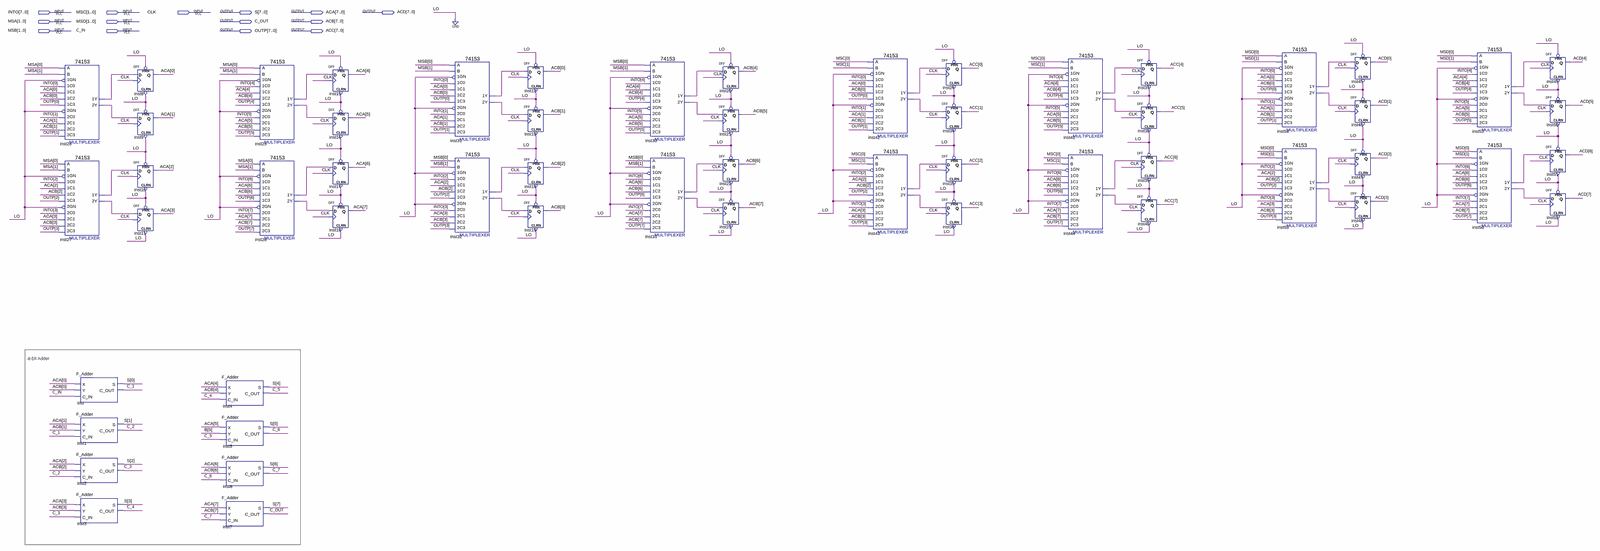
[diagram p0: schematic sheet, whole]
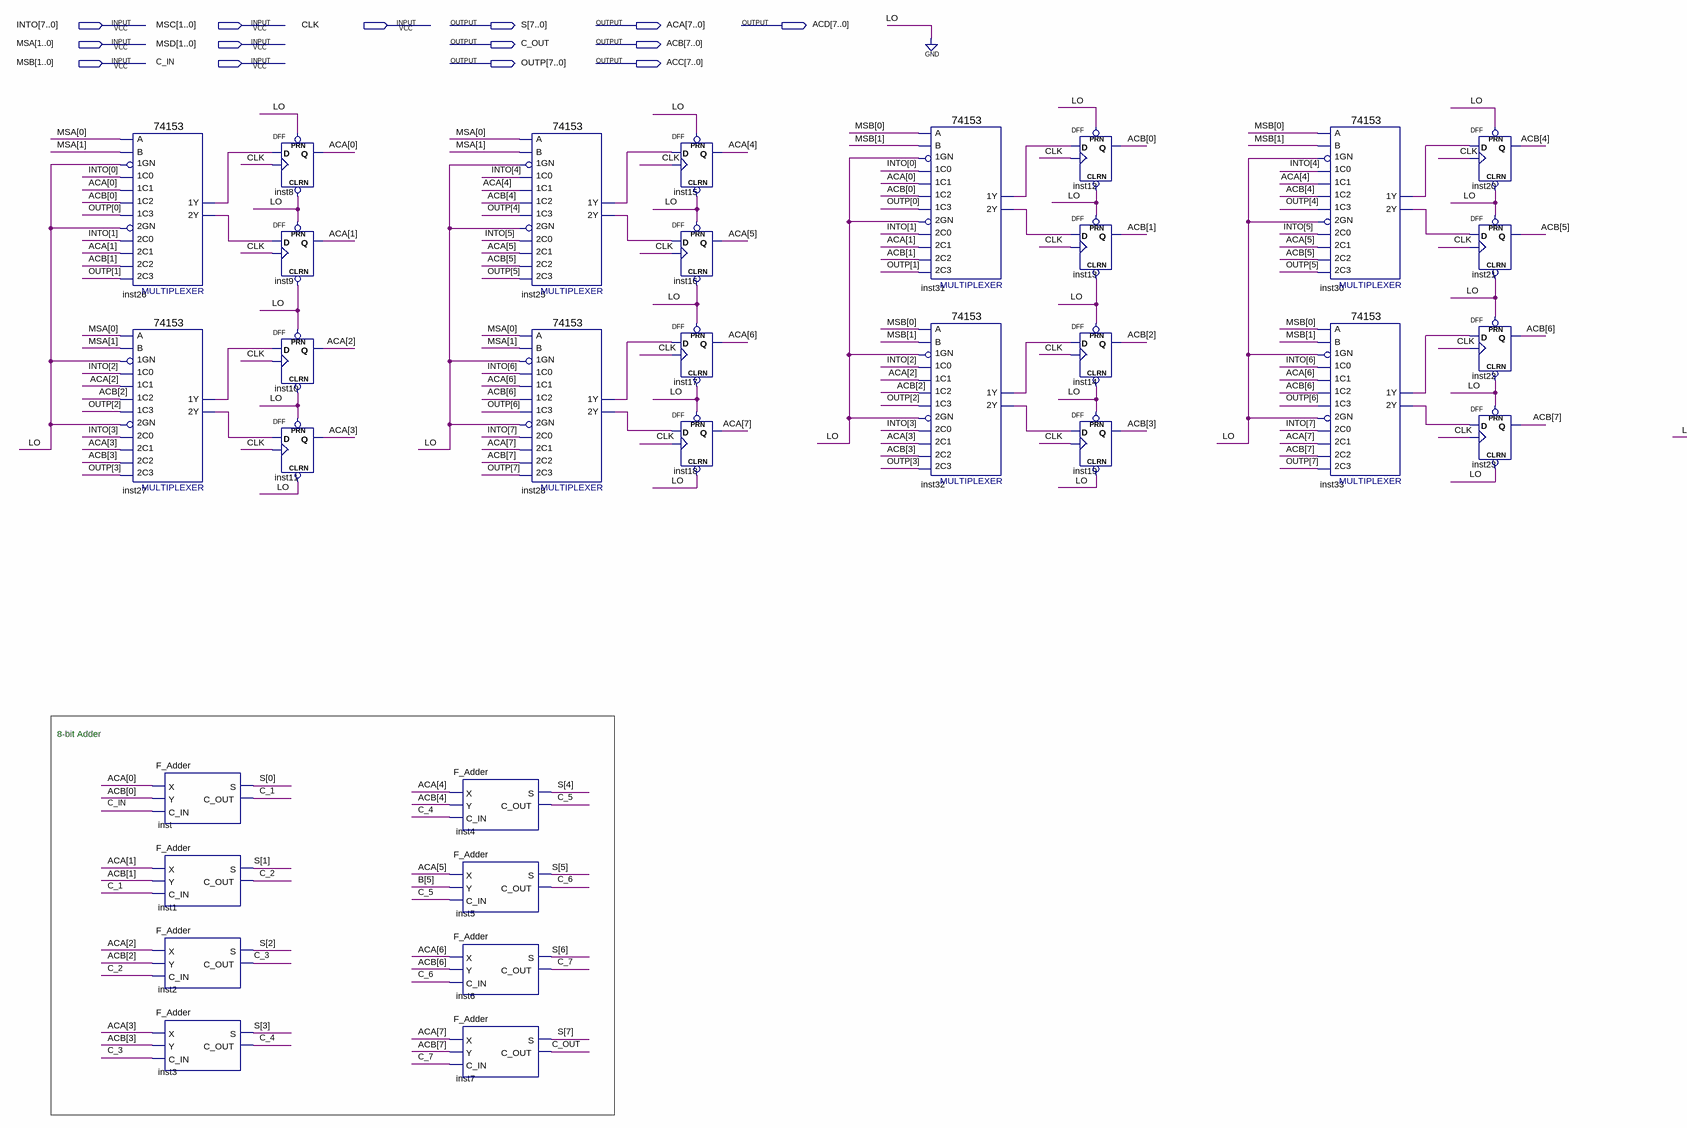
[diagram p1: schematic sheet, left part]
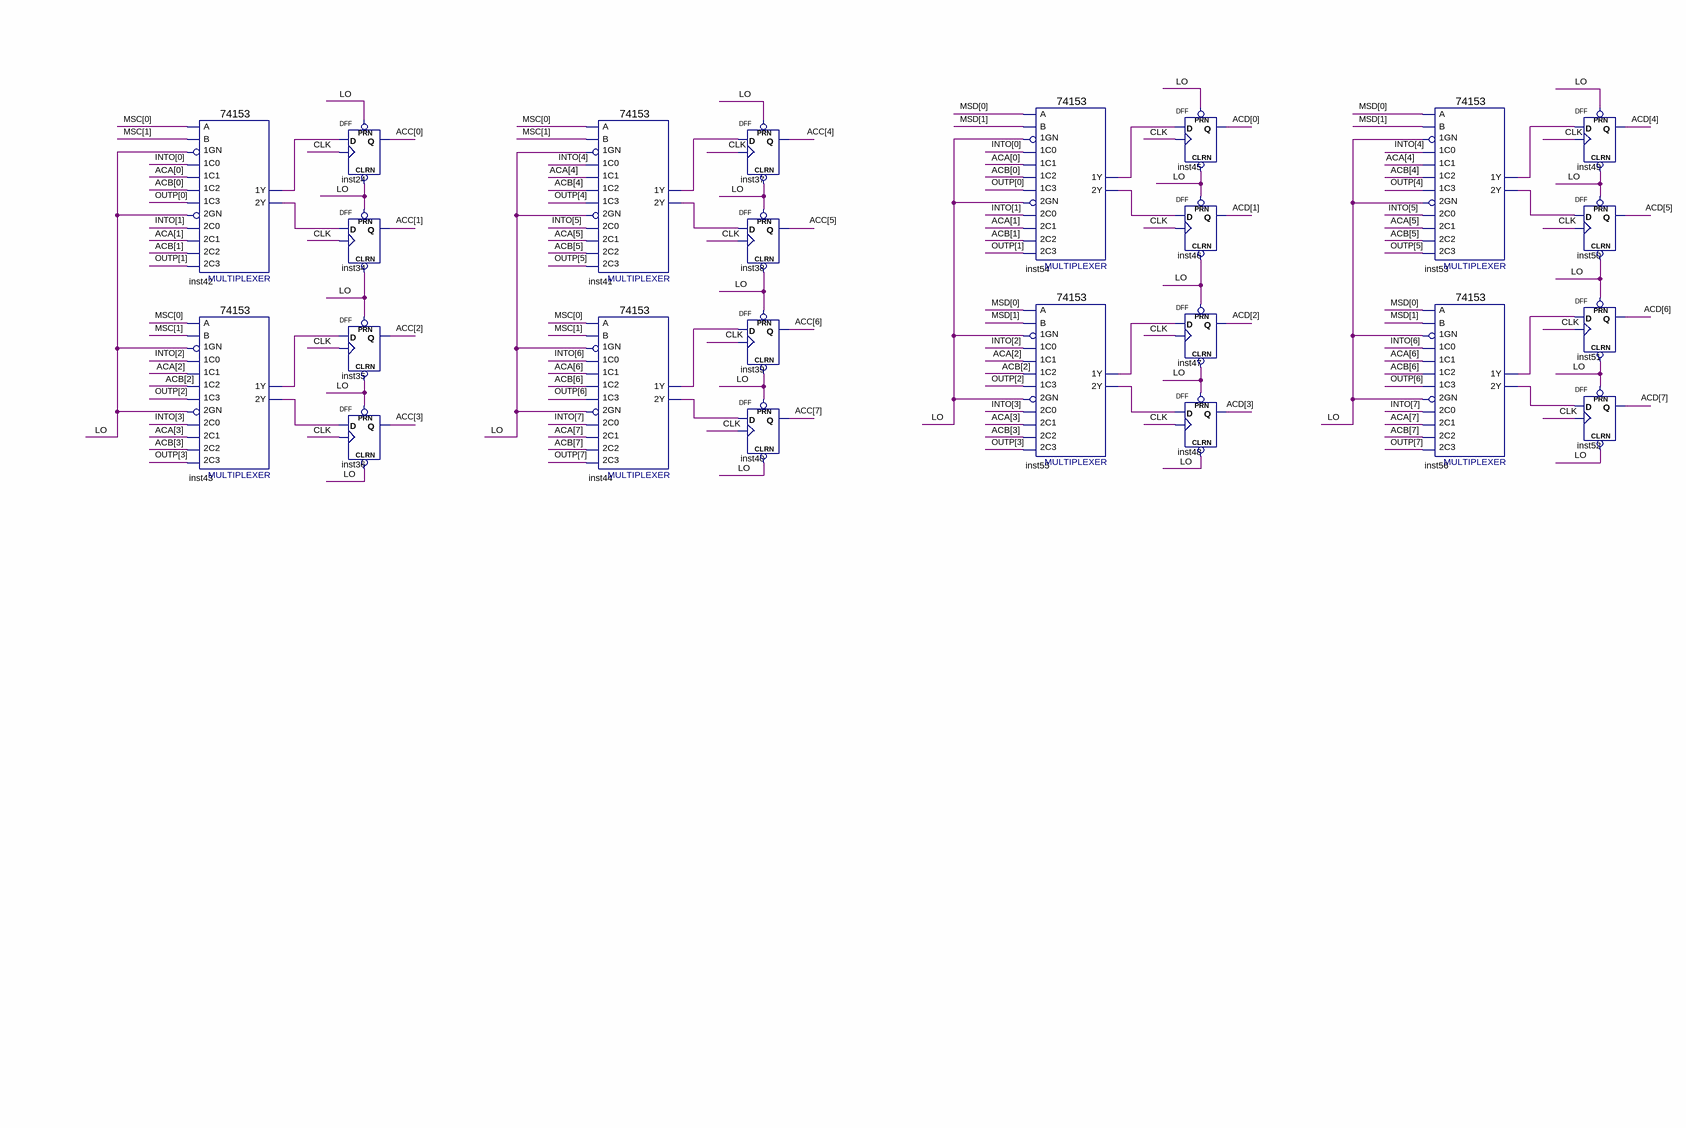
[diagram p2: schematic sheet, right part]
// Quartus schematic V_ALU.bdf as structural Verilog: 56 symbols, 14 pins
module V_ALU (
  input  [7:0] INTO,
  input  [1:0] MSC,
  input  CLK,
  input  [1:0] MSA,
  input  [1:0] MSD,
  input  [1:0] MSB,
  input  C_IN,
  output [7:0] S,
  output [7:0] ACA,
  output [7:0] ACD,
  output C_OUT,
  output [7:0] ACB,
  output [7:0] OUTP,
  output [7:0] ACC
);

  wire C_1, C_2, C_3, C_4, C_5, C_6, C_7, inst25_1y, inst25_2y, inst26_1y, inst26_2y, inst27_1y, inst27_2y,
       inst28_1y, inst28_2y, inst30_1y, inst30_2y, inst31_1y, inst31_2y, inst32_1y, inst32_2y, inst33_1y,
       inst33_2y, inst41_1y, inst41_2y, inst42_1y, inst42_2y, inst43_1y, inst43_2y, inst44_1y, inst44_2y,
       inst53_1y, inst53_2y, inst54_1y, inst54_2y, inst55_1y, inst55_2y, inst56_1y, inst56_2y;
  wire [5:5] B;

  \74153  inst26 (
    .\1C1 (ACA[0]), .\1GN (1'b0), .\1C0 (INTO[0]), .\2C0 (INTO[1]), .\2GN (1'b0), .\2C2 (ACB[1]),
    .\1C2 (ACB[0]), .\1C3 (OUTP[0]), .B(MSA[1]), .A(MSA[0]), .\2C1 (ACA[1]), .\2C3 (OUTP[1]),
    .\1Y (inst26_1y), .\2Y (inst26_2y));
  \74153  inst27 (
    .\1C1 (ACA[2]), .\1GN (1'b0), .\1C0 (INTO[2]), .\2C0 (INTO[3]), .\2GN (1'b0), .\2C2 (ACB[3]),
    .\1C2 (ACB[2]), .\1C3 (OUTP[2]), .B(MSA[1]), .A(MSA[0]), .\2C1 (ACA[3]), .\2C3 (OUTP[3]),
    .\1Y (inst27_1y), .\2Y (inst27_2y));
  F_Adder inst (.X(ACA[0]), .Y(ACB[0]), .C_IN(C_IN), .S(S[0]), .C_OUT(C_1));
  F_Adder inst1 (.X(ACA[1]), .Y(ACB[1]), .C_IN(C_1), .S(S[1]), .C_OUT(C_2));
  F_Adder inst2 (.X(ACA[2]), .Y(ACB[2]), .C_IN(C_2), .S(S[2]), .C_OUT(C_3));
  F_Adder inst3 (.X(ACA[3]), .Y(ACB[3]), .C_IN(C_3), .S(S[3]), .C_OUT(C_4));
  DFF inst8 (.CLRN(1'b0), .CLK(CLK), .D(inst26_1y), .PRN(1'b0), .Q(ACA[0]));
  DFF inst9 (.CLRN(1'b0), .CLK(CLK), .D(inst26_2y), .PRN(1'b0), .Q(ACA[1]));
  DFF inst10 (.CLRN(1'b0), .CLK(CLK), .D(inst27_1y), .PRN(1'b0), .Q(ACA[2]));
  DFF inst11 (.CLRN(1'b0), .CLK(CLK), .D(inst27_2y), .PRN(1'b0), .Q(ACA[3]));
  F_Adder inst4 (.X(ACA[4]), .Y(ACB[4]), .C_IN(C_4), .S(S[4]), .C_OUT(C_5));
  F_Adder inst5 (.X(ACA[5]), .Y(B[5]), .C_IN(C_5), .S(S[5]), .C_OUT(C_6));
  F_Adder inst6 (.X(ACA[6]), .Y(ACB[6]), .C_IN(C_6), .S(S[6]), .C_OUT(C_7));
  F_Adder inst7 (.X(ACA[7]), .Y(ACB[7]), .C_IN(C_7), .S(S[7]), .C_OUT(C_OUT));
  \74153  inst25 (
    .\1C1 (ACA[4]), .\1GN (1'b0), .\1C0 (INTO[4]), .\2C0 (INTO[5]), .\2GN (1'b0), .\2C2 (ACB[5]),
    .\1C2 (ACB[4]), .\1C3 (OUTP[4]), .B(MSA[1]), .A(MSA[0]), .\2C1 (ACA[5]), .\2C3 (OUTP[5]),
    .\1Y (inst25_1y), .\2Y (inst25_2y));
  \74153  inst28 (
    .\1C1 (ACA[6]), .\1GN (1'b0), .\1C0 (INTO[6]), .\2C0 (INTO[7]), .\2GN (1'b0), .\2C2 (ACB[7]),
    .\1C2 (ACB[6]), .\1C3 (OUTP[6]), .B(MSA[1]), .A(MSA[0]), .\2C1 (ACA[7]), .\2C3 (OUTP[7]),
    .\1Y (inst28_1y), .\2Y (inst28_2y));
  DFF inst15 (.CLRN(1'b0), .CLK(CLK), .D(inst25_1y), .PRN(1'b0), .Q(ACA[4]));
  DFF inst16 (.CLRN(1'b0), .CLK(CLK), .D(inst25_2y), .PRN(1'b0), .Q(ACA[5]));
  DFF inst17 (.CLRN(1'b0), .CLK(CLK), .D(inst28_1y), .PRN(1'b0), .Q(ACA[6]));
  DFF inst18 (.CLRN(1'b0), .CLK(CLK), .D(inst28_2y), .PRN(1'b0), .Q(ACA[7]));
  \74153  inst31 (
    .\1C1 (ACA[0]), .\1GN (1'b0), .\1C0 (INTO[0]), .\2C0 (INTO[1]), .\2GN (1'b0), .\2C2 (ACB[1]),
    .\1C2 (ACB[0]), .\1C3 (OUTP[0]), .B(MSB[1]), .A(MSB[0]), .\2C1 (ACA[1]), .\2C3 (OUTP[1]),
    .\1Y (inst31_1y), .\2Y (inst31_2y));
  \74153  inst32 (
    .\1C1 (ACA[2]), .\1GN (1'b0), .\1C0 (INTO[2]), .\2C0 (INTO[3]), .\2GN (1'b0), .\2C2 (ACB[3]),
    .\1C2 (ACB[2]), .\1C3 (OUTP[2]), .B(MSB[1]), .A(MSB[0]), .\2C1 (ACA[3]), .\2C3 (OUTP[3]),
    .\1Y (inst32_1y), .\2Y (inst32_2y));
  DFF inst12 (.CLRN(1'b0), .CLK(CLK), .D(inst31_1y), .PRN(1'b0), .Q(ACB[0]));
  DFF inst13 (.CLRN(1'b0), .CLK(CLK), .D(inst31_2y), .PRN(1'b0), .Q(ACB[1]));
  DFF inst14 (.CLRN(1'b0), .CLK(CLK), .D(inst32_1y), .PRN(1'b0), .Q(ACB[2]));
  DFF inst19 (.CLRN(1'b0), .CLK(CLK), .D(inst32_2y), .PRN(1'b0), .Q(ACB[3]));
  \74153  inst30 (
    .\1C1 (ACA[4]), .\1GN (1'b0), .\1C0 (INTO[4]), .\2C0 (INTO[5]), .\2GN (1'b0), .\2C2 (ACB[5]),
    .\1C2 (ACB[4]), .\1C3 (OUTP[4]), .B(MSB[1]), .A(MSB[0]), .\2C1 (ACA[5]), .\2C3 (OUTP[5]),
    .\1Y (inst30_1y), .\2Y (inst30_2y));
  \74153  inst33 (
    .\1C1 (ACA[6]), .\1GN (1'b0), .\1C0 (INTO[6]), .\2C0 (INTO[7]), .\2GN (1'b0), .\2C2 (ACB[7]),
    .\1C2 (ACB[6]), .\1C3 (OUTP[6]), .B(MSB[1]), .A(MSB[0]), .\2C1 (ACA[7]), .\2C3 (OUTP[7]),
    .\1Y (inst33_1y), .\2Y (inst33_2y));
  DFF inst20 (.CLRN(1'b0), .CLK(CLK), .D(inst30_1y), .PRN(1'b0), .Q(ACB[4]));
  DFF inst21 (.CLRN(1'b0), .CLK(CLK), .D(inst30_2y), .PRN(1'b0), .Q(ACB[5]));
  DFF inst22 (.CLRN(1'b0), .CLK(CLK), .D(inst33_1y), .PRN(1'b0), .Q(ACB[6]));
  DFF inst23 (.CLRN(1'b0), .CLK(CLK), .D(inst33_2y), .PRN(1'b0), .Q(ACB[7]));
  \74153  inst42 (
    .\1C1 (ACA[0]), .\1GN (1'b0), .\1C0 (INTO[0]), .\2C0 (INTO[1]), .\2GN (1'b0), .\2C2 (ACB[1]),
    .\1C2 (ACB[0]), .\1C3 (OUTP[0]), .B(MSC[1]), .A(MSC[0]), .\2C1 (ACA[1]), .\2C3 (OUTP[1]),
    .\1Y (inst42_1y), .\2Y (inst42_2y));
  \74153  inst43 (
    .\1C1 (ACA[2]), .\1GN (1'b0), .\1C0 (INTO[2]), .\2C0 (INTO[3]), .\2GN (1'b0), .\2C2 (ACB[3]),
    .\1C2 (ACB[2]), .\1C3 (OUTP[2]), .B(MSC[1]), .A(MSC[0]), .\2C1 (ACA[3]), .\2C3 (OUTP[3]),
    .\1Y (inst43_1y), .\2Y (inst43_2y));
  DFF inst24 (.CLRN(1'b0), .CLK(CLK), .D(inst42_1y), .PRN(1'b0), .Q(ACC[0]));
  DFF inst34 (.CLRN(1'b0), .CLK(CLK), .D(inst42_2y), .PRN(1'b0), .Q(ACC[1]));
  DFF inst35 (.CLRN(1'b0), .CLK(CLK), .D(inst43_1y), .PRN(1'b0), .Q(ACC[2]));
  DFF inst36 (.CLRN(1'b0), .CLK(CLK), .D(inst43_2y), .PRN(1'b0), .Q(ACC[3]));
  \74153  inst41 (
    .\1C1 (ACA[4]), .\1GN (1'b0), .\1C0 (INTO[4]), .\2C0 (INTO[5]), .\2GN (1'b0), .\2C2 (ACB[5]),
    .\1C2 (ACB[4]), .\1C3 (OUTP[4]), .B(MSC[1]), .A(MSC[0]), .\2C1 (ACA[5]), .\2C3 (OUTP[5]),
    .\1Y (inst41_1y), .\2Y (inst41_2y));
  \74153  inst44 (
    .\1C1 (ACA[6]), .\1GN (1'b0), .\1C0 (INTO[6]), .\2C0 (INTO[7]), .\2GN (1'b0), .\2C2 (ACB[7]),
    .\1C2 (ACB[6]), .\1C3 (OUTP[6]), .B(MSC[1]), .A(MSC[0]), .\2C1 (ACA[7]), .\2C3 (OUTP[7]),
    .\1Y (inst44_1y), .\2Y (inst44_2y));
  DFF inst37 (.CLRN(1'b0), .CLK(CLK), .D(inst41_1y), .PRN(1'b0), .Q(ACC[4]));
  DFF inst38 (.CLRN(1'b0), .CLK(CLK), .D(inst41_2y), .PRN(1'b0), .Q(ACC[5]));
  DFF inst39 (.CLRN(1'b0), .CLK(CLK), .D(inst44_1y), .PRN(1'b0), .Q(ACC[6]));
  DFF inst40 (.CLRN(1'b0), .CLK(CLK), .D(inst44_2y), .PRN(1'b0), .Q(ACC[7]));
  \74153  inst54 (
    .\1C1 (ACA[0]), .\1GN (1'b0), .\1C0 (INTO[0]), .\2C0 (INTO[1]), .\2GN (1'b0), .\2C2 (ACB[1]),
    .\1C2 (ACB[0]), .\1C3 (OUTP[0]), .B(MSD[1]), .A(MSD[0]), .\2C1 (ACA[1]), .\2C3 (OUTP[1]),
    .\1Y (inst54_1y), .\2Y (inst54_2y));
  \74153  inst55 (
    .\1C1 (ACA[2]), .\1GN (1'b0), .\1C0 (INTO[2]), .\2C0 (INTO[3]), .\2GN (1'b0), .\2C2 (ACB[3]),
    .\1C2 (ACB[2]), .\1C3 (OUTP[2]), .B(MSD[1]), .A(MSD[0]), .\2C1 (ACA[3]), .\2C3 (OUTP[3]),
    .\1Y (inst55_1y), .\2Y (inst55_2y));
  DFF inst45 (.CLRN(1'b0), .CLK(CLK), .D(inst54_1y), .PRN(1'b0), .Q(ACD[0]));
  DFF inst46 (.CLRN(1'b0), .CLK(CLK), .D(inst54_2y), .PRN(1'b0), .Q(ACD[1]));
  DFF inst47 (.CLRN(1'b0), .CLK(CLK), .D(inst55_1y), .PRN(1'b0), .Q(ACD[2]));
  DFF inst48 (.CLRN(1'b0), .CLK(CLK), .D(inst55_2y), .PRN(1'b0), .Q(ACD[3]));
  \74153  inst53 (
    .\1C1 (ACA[4]), .\1GN (1'b0), .\1C0 (INTO[4]), .\2C0 (INTO[5]), .\2GN (1'b0), .\2C2 (ACB[5]),
    .\1C2 (ACB[4]), .\1C3 (OUTP[4]), .B(MSD[1]), .A(MSD[0]), .\2C1 (ACA[5]), .\2C3 (OUTP[5]),
    .\1Y (inst53_1y), .\2Y (inst53_2y));
  \74153  inst56 (
    .\1C1 (ACA[6]), .\1GN (1'b0), .\1C0 (INTO[6]), .\2C0 (INTO[7]), .\2GN (1'b0), .\2C2 (ACB[7]),
    .\1C2 (ACB[6]), .\1C3 (OUTP[6]), .B(MSD[1]), .A(MSD[0]), .\2C1 (ACA[7]), .\2C3 (OUTP[7]),
    .\1Y (inst56_1y), .\2Y (inst56_2y));
  DFF inst49 (.CLRN(1'b0), .CLK(CLK), .D(inst53_1y), .PRN(1'b0), .Q(ACD[4]));
  DFF inst50 (.CLRN(1'b0), .CLK(CLK), .D(inst53_2y), .PRN(1'b0), .Q(ACD[5]));
  DFF inst51 (.CLRN(1'b0), .CLK(CLK), .D(inst56_1y), .PRN(1'b0), .Q(ACD[6]));
  DFF inst52 (.CLRN(1'b0), .CLK(CLK), .D(inst56_2y), .PRN(1'b0), .Q(ACD[7]));

  // Notes on the sheet:
  //   8-bit Adder
endmodule
